# Altium schematic sheet Sample_v1.SchDoc
size A4; SheetNumber: 1; SheetTotal: 5
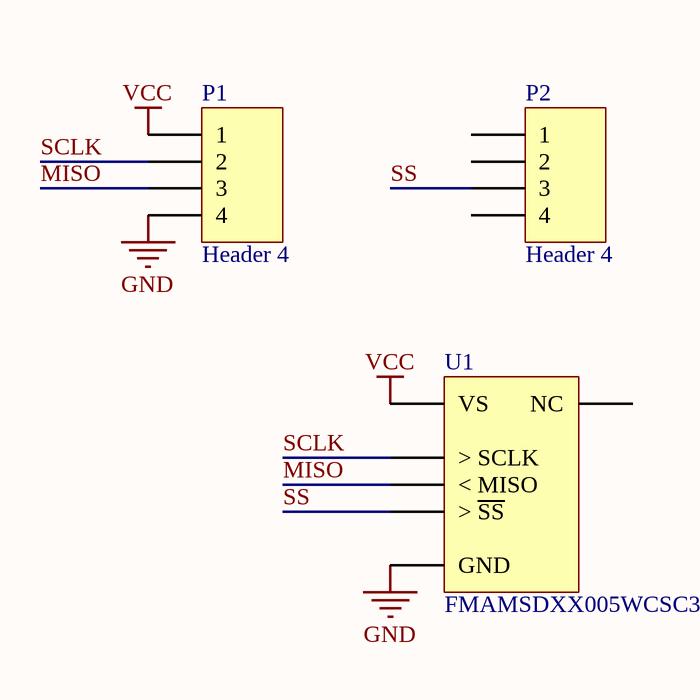
[diagram p0: Sample_v1.SchDoc]

## Parts
P1  Header 4  [HDR1X4]
P2  Header 4  [HDR1X4]
U1  FMAMSDXX005WCSC3  [FMA_MICROFORCE_6]

## Nets
GND: P1.4 U1.3(GND)
VCC: P1.1 U1.1(VS)
MISO: P1.3 U1.5(<_MISO)
SCLK: P1.2 U1.4(>_SCLK)
SS: P2.3 U1.2(>_~{SS})

Not connected (* = marked no-connect by the designer): P2 1 2 4; U1 6(NC)

## Library data of the parts
P1 P2 = Header 4: Header, 4-Pin; LatestRevisionDate: 17-Jul-2002; LatestRevisionNote: Re-released for DXP Platform.; Publisher: Altium Limited
U1 = FMAMSDXX005WCSC3: Force Range: 5N / Output: SPI / FMA Series Force Sensor, compensated/amplified, mechanically / coupled, sphere contact element, sensor short and open / diagnostics, 5 N force range, compression force type, SPI digital / output, 20% to 80% transfer function, 3.3 V ±10% supply voltage